# EAGLE design PaxInstrument-T400D (EAGLE 6.5.0)
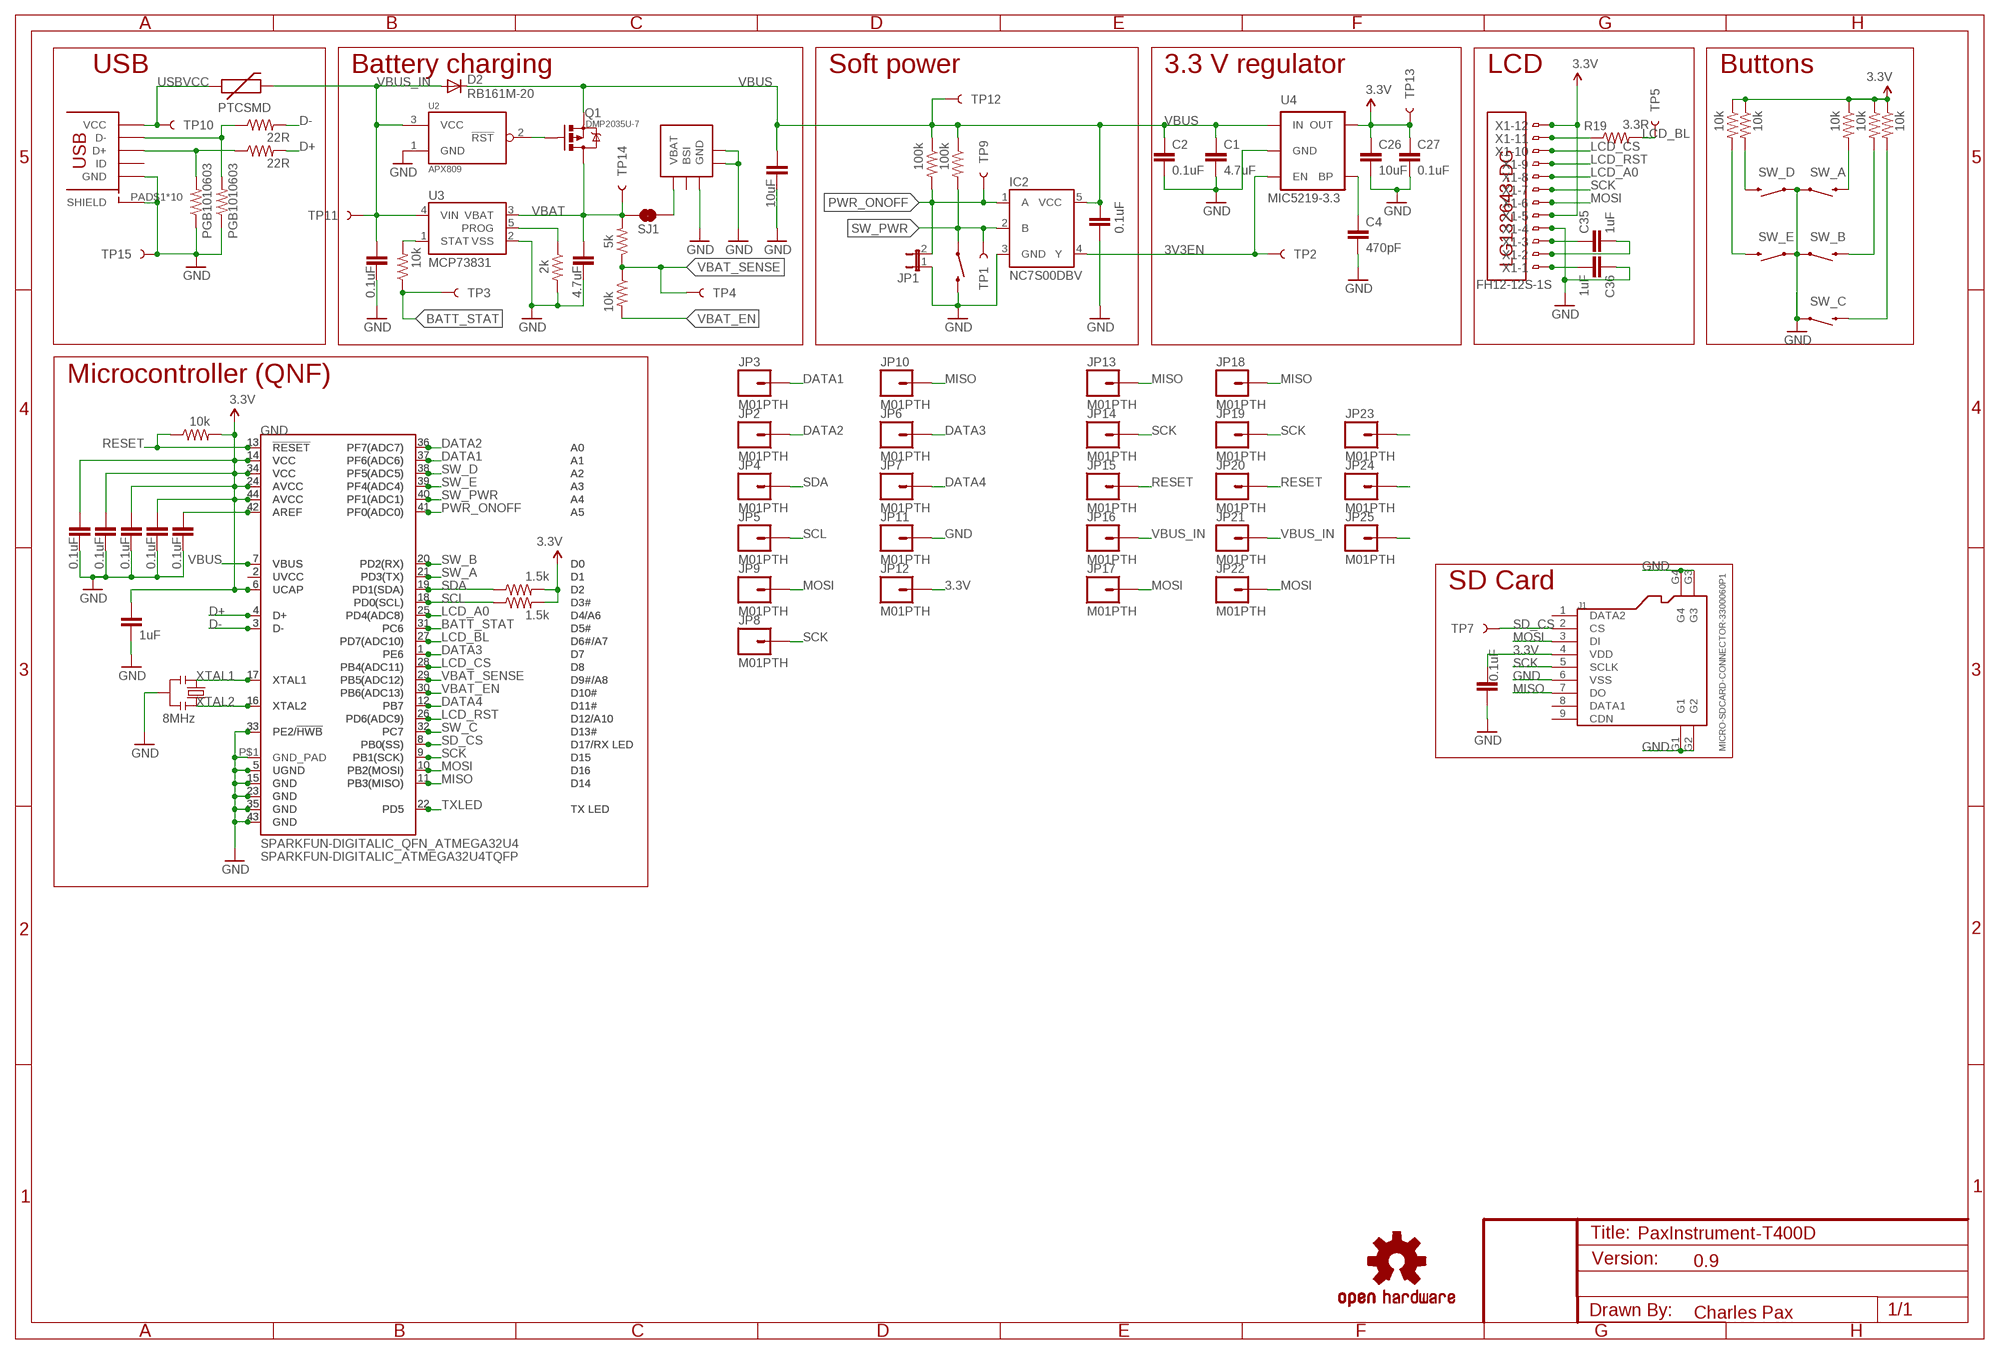
[diagram p0: schematic, sheet 1]

## Parts
C1  4.7uF  SPARKFUN-CAPACITORS_CAP0603-CAP  [SPARKFUN-CAPACITORS_0603-CAP]
C2  0.1uF  SPARKFUN-CAPACITORS_CAP0603-CAP  [SPARKFUN-CAPACITORS_0603-CAP]
C3  0.1uF  SPARKFUN-CAPACITORS_CAP0603-CAP  [SPARKFUN-CAPACITORS_0603-CAP]
C4  470pF  SPARKFUN-CAPACITORS_CAP0603-CAP  [SPARKFUN-CAPACITORS_0603-CAP]
C5  0.1uF  SPARKFUN-CAPACITORS_CAP0603-CAP  [SPARKFUN-CAPACITORS_0603-CAP]
C6  0.1uF  SPARKFUN-CAPACITORS_CAP0603-CAP  [SPARKFUN-CAPACITORS_0603-CAP]
C9  4.7uF  SPARKFUN-CAPACITORS_CAP0603-CAP  [SPARKFUN-CAPACITORS_0603-CAP]
C12  10uF  SPARKFUN-CAPACITORS_CAP0603-CAP  [SPARKFUN-CAPACITORS_0603-CAP]
C19  1uF  SPARKFUN-CAPACITORS_CAP0603-CAP  [SPARKFUN-CAPACITORS_0603-CAP]
C21  0.1uF  SPARKFUN-CAPACITORS_CAP0603-CAP  [SPARKFUN-CAPACITORS_0603-CAP]
C26  10uF  SPARKFUN-CAPACITORS_CAP0603-CAP  [SPARKFUN-CAPACITORS_0603-CAP]
C27  0.1uF  SPARKFUN-CAPACITORS_CAP0603-CAP  [SPARKFUN-CAPACITORS_0603-CAP]
C28  0.1uF  SPARKFUN-CAPACITORS_CAP0603-CAP  [SPARKFUN-CAPACITORS_0603-CAP]
C32  0.1uF  SPARKFUN-CAPACITORS_CAP0603-CAP  [SPARKFUN-CAPACITORS_0603-CAP]
C33  0.1uF  SPARKFUN-CAPACITORS_CAP0603-CAP  [SPARKFUN-CAPACITORS_0603-CAP]
C34  0.1uF  SPARKFUN-CAPACITORS_CAP0603-CAP  [SPARKFUN-CAPACITORS_0603-CAP]
C35  1uF  SPARKFUN-CAPACITORS_CAP0603-CAP  [SPARKFUN-CAPACITORS_0603-CAP]
C36  1uF  SPARKFUN-CAPACITORS_CAP0603-CAP  [SPARKFUN-CAPACITORS_0603-CAP]
D2  RB161M-20  SPARKFUN-DISCRETESEMI_DIODESOD123SOD123  [SOD123]
F1  PTCSMD  [PTC-1206]
GND  SPARKFUN-DIGITALIC_QFN_ATMEGA32U4  [SPARKFUN-DIGITALIC_SPARKFUN-DIGITALIC_QFN-44]
IC2  NC7S00DBV  [CHARLESPAX_SOT23-5]
J1  MICRO-SDCARD-CONNECTOR-3300060P1  [9P-SMD-W-RING]
JP1  JUMPER-2SMD-NO  [SJ_2S-NO]
JP2  M01PTH  [1X01]
JP3  M01PTH  [1X01]
JP4  M01PTH  [1X01]
JP5  M01PTH  [1X01]
JP6  M01PTH  [1X01]
JP7  M01PTH  [1X01]
JP8  M01PTH  [1X01]
JP9  M01PTH  [1X01]
JP10  M01PTH  [1X01]
JP11  M01PTH  [1X01]
JP12  M01PTH  [1X01]
JP13  M01PTH  [1X01]
JP14  M01PTH  [1X01]
JP15  M01PTH  [1X01]
JP16  M01PTH  [1X01]
JP17  M01PTH  [1X01]
JP18  M01PTH  [1X01]
JP19  M01PTH  [1X01]
JP20  M01PTH  [1X01]
JP21  M01PTH  [1X01]
JP22  M01PTH  [1X01]
JP23  M01PTH  [1X01]
JP24  M01PTH  [1X01]
JP25  M01PTH  [1X01]
LOGO1  OSHW-LOGOS  [OSHW-LOGO-S]
Q1  DMP2035U-7  MOSFET-PCHANNELSMT  [SOT23]
R3  2k  SPARKFUN-RESISTORS_RESISTOR0603-RES  [SPARKFUN-RESISTORS_0603-RES]
R4  10k  SPARKFUN-RESISTORS_RESISTOR0603-RES  [SPARKFUN-RESISTORS_0603-RES]
R6  100k  SPARKFUN-RESISTORS_RESISTOR0603-RES  [SPARKFUN-RESISTORS_0603-RES]
R7  100k  SPARKFUN-RESISTORS_RESISTOR0603-RES  [SPARKFUN-RESISTORS_0603-RES]
R8  10k  SPARKFUN-RESISTORS_RESISTOR0603-RES  [SPARKFUN-RESISTORS_0603-RES]
R9  22R  SPARKFUN-RESISTORS_RESISTOR0603-RES  [SPARKFUN-RESISTORS_0603-RES]
R10  22R  SPARKFUN-RESISTORS_RESISTOR0603-RES  [SPARKFUN-RESISTORS_0603-RES]
R11  10k  SPARKFUN-RESISTORS_RESISTOR0603-RES  [SPARKFUN-RESISTORS_0603-RES]
R12  10k  SPARKFUN-RESISTORS_RESISTOR0603-RES  [SPARKFUN-RESISTORS_0603-RES]
R13  1.5k  SPARKFUN-RESISTORS_RESISTOR0603-RES  [SPARKFUN-RESISTORS_0603-RES]
R14  1.5k  SPARKFUN-RESISTORS_RESISTOR0603-RES  [SPARKFUN-RESISTORS_0603-RES]
R15  10k  SPARKFUN-RESISTORS_RESISTOR0603-RES  [SPARKFUN-RESISTORS_0603-RES]
R16  10k  SPARKFUN-RESISTORS_RESISTOR0603-RES  [SPARKFUN-RESISTORS_0603-RES]
R17  10k  SPARKFUN-RESISTORS_RESISTOR0603-RES  [SPARKFUN-RESISTORS_0603-RES]
R19  3.3R  SPARKFUN-RESISTORS_RESISTOR0603-RES  [SPARKFUN-RESISTORS_0603-RES]
R20  5k  SPARKFUN-RESISTORS_RESISTOR0603-RES  [SPARKFUN-RESISTORS_0603-RES]
R24  10k  SPARKFUN-RESISTORS_RESISTOR0603-RES  [SPARKFUN-RESISTORS_0603-RES]
S1  SWITCH-MOMENTARY-2SMD  [TACTILE_SWITCH_SMD]
S2  SWITCH-MOMENTARY-2SMD  [TACTILE_SWITCH_SMD]
S3  SWITCH-MOMENTARY-2SMD  [TACTILE_SWITCH_SMD]
S4  SWITCH-MOMENTARY-2SMD  [TACTILE_SWITCH_SMD]
S5  SWITCH-MOMENTARY-2SMD  [TACTILE_SWITCH_SMD]
S6  SWITCH-MOMENTARY-2SMD  [TACTILE_SWITCH_SMD]
SJ1  JUMPER-PAD-2-NC_BY_TRACE  [PAD-JUMPER-2-NC_BY_TRACE_YES_SILK]
TP1  SW_PWR  TEST-POINTTP_15TH_THRU  [TP_15TH]
TP2  3V3_EN  TEST-POINTTP_15TH_THRU  [TP_15TH]
TP3  BATT_STAT  TEST-POINTTP_15TH_THRU  [TP_15TH]
TP4  VBAT_SENSE  TEST-POINTTP_15TH_THRU  [TP_15TH]
TP5  LCD_BL  TEST-POINTTP_15TH_THRU  [TP_15TH]
TP7  SD_CS  TEST-POINTTP_15TH_THRU  [TP_15TH]
TP9  PWR_ON/OFF  TEST-POINTTP_15TH_THRU  [TP_15TH]
TP10  TEST-POINTTP_15TH_THRU  [TP_15TH]
TP11  VBUS_IN  TEST-POINTTP_15TH_THRU  [TP_15TH]
TP12  VBUS  TEST-POINTTP_15TH_THRU  [TP_15TH]
TP13  3.3V  TEST-POINTTP_15TH_THRU  [TP_15TH]
TP14  VBAT  TEST-POINTTP_15TH_THRU  [TP_15TH]
TP15  GND  TEST-POINTTP_15TH_THRU  [TP_15TH]
U2  APX809  [SOT23]
U3  MCP73831  [SOT23-5]
U4  MIC5219-3.3V  V_REG_LDOSMD  [SOT23-5]
U$1  USB_MICROSMT+THRUHULE  [USB_MICRO_THRUHOLE]
U$2  BL-5C-CONNECTOR  [BL-5C-CONNECTOR]
U$3  SPARKFUN-DIGITALIC_ATMEGA32U4TQFP  [SPARKFUN-DIGITALIC_SPARKFUN-DIGITALIC_TQFP44]
U$5  LG132643-DG  [LG132643-DG]
X1  FH12-12S-1S  [FH12-12S-1SH]
X2  FH12-12S-0.5SH  [FH12-12S-0.5SH]
Y1  RESONATORSMD  [RESONATOR-SMD]
Z1  PGB1010603  SPARKFUN-RESISTORS_RESISTOR0603-RES  [SPARKFUN-RESISTORS_0603-RES]
Z2  PGB1010603  SPARKFUN-RESISTORS_RESISTOR0603-RES  [SPARKFUN-RESISTORS_0603-RES]

## Nets
3.3V: C5.1 C19.1 C21.2 C26.1 C27.1 C32.1 C33.1 C34.1 GND.6(UCAP) GND.14(VCC) GND.24(AVCC) GND.34(VCC) GND.44(AVCC) J1.4(VDD) JP12.1 R4.2 R8.1 R11.1 R12.1 R13.2 R14.2 R15.1 R16.1 TP13.P$1 U4.5(OUT) U$3.6(UCAP) U$3.14(VCC) U$3.24(AVCC) U$3.34(VCC) U$3.44(AVCC) X1.5 X1.12 X2.5 X2.12
3V3EN: IC2.4(Y) TP2.P$1 U4.3(EN)
BATT_STAT: GND.31(PC6) R17.1 TP3.P$1 U$3.31(PC6)
D+: GND.4(D+) R9.2 U$3.4(D+)
D-: GND.3(D-) R10.2 U$3.3(D-)
DATA1: GND.37(PF6(ADC6)) JP3.1 U$3.37(PF6(ADC6))
DATA2: GND.36(PF7(ADC7)) JP2.1 U$3.36(PF7(ADC7))
DATA3: GND.1(PE6) JP6.1 U$3.1(PE6)
DATA4: GND.12(PB7) JP7.1 U$3.12(PB7)
GND: C1.2 C2.2 C3.2 C4.2 C5.2 C6.2 C9.2 C12.2 C19.2 C21.1 C26.2 C27.2 C28.2 C32.2 C33.2 C34.2 C36.1 GND.5(UGND) GND.15(GND) GND.23(GND) GND.33(PE2/!HWB) GND.35(GND) GND.43(GND) GND.P$1(GND_PAD) IC2.3(GND) J1.6(VSS) J1.G1 J1.G2 J1.G3 J1.G4 JP1.1 JP11.1 R3.2 S1.1 S2.1 S3.1 S4.1 S5.1 S6.3 TP15.P$1 U2.1(GND) U3.2(VSS) U4.2(GND) U$1.PAD$1(SHIELD) U$1.PAD$2(SHIELD) U$1.PAD$3(SHIELD) U$1.PAD$4(SHIELD) U$1.PAD$5(SHIELD) U$1.PAD$6(SHIELD) U$1.PAD$7(SHIELD) U$1.PAD$8(SHIELD) U$1.PAD$9(SHIELD) U$1.PAD$10(SHIELD) U$1.PIN$5(GND) U$2.P$3(GND) U$2.P$4 U$2.P$5 U$3.5(UGND) U$3.15(GND) U$3.23(GND) U$3.33(PE2/!HWB) U$3.35(GND) U$3.43(GND) X1.4 X2.4 Y1.2 Z1.1 Z2.1
LCD_A0: GND.25(PD4(ADC8)) U$3.25(PD4(ADC8)) X1.8 X2.8
LCD_BL: GND.27(PD7(ADC10)) R19.2 TP5.P$1 U$3.27(PD7(ADC10))
LCD_CS: GND.28(PB4(ADC11)) U$3.28(PB4(ADC11)) X1.10 X2.10
LCD_RST: GND.26(PD6(ADC9)) U$3.26(PD6(ADC9)) X1.9 X2.9
MISO: GND.11(PB3(MISO)) J1.7(DO) JP10.1 JP13.1 JP18.1 U$3.11(PB3(MISO))
MOSI: GND.10(PB2(MOSI)) J1.3(DI) JP9.1 JP17.1 JP22.1 U$3.10(PB2(MOSI)) X1.6 X2.6
MOSI2: JP25.1
N$1: C4.1 U4.4(BP)
N$2: R17.2 U3.1(STAT)
N$4: R19.1 X1.11 X2.11
N$7: R3.1 U3.5(PROG)
N$10: SJ1.2 U$2.P$1(VBAT)
N$12: Q1.1(G) U2.2(!RST)
N$15: C3.1 GND.42(AREF) U$3.42(AREF)
N$17: GND.2(UVCC) U$3.2(UVCC)
N$31: R10.1 U$1.PIN$2(D-) Z2.2
N$33: R9.1 U$1.PIN$3(D+) Z1.2
N$37: C35.1 X1.3 X2.3
N$38: C35.2 X1.2 X2.2
N$39: C36.2 X1.1 X2.1
PWR_ONOFF: GND.41(PF0(ADC0)) IC2.1(A) JP1.2 R7.2 TP9.P$1 U$3.41(PF0(ADC0))
RESET: GND.13(!RESET) JP15.1 JP20.1 R4.1 U$3.13(!RESET)
RESET1: JP23.1
SCK: GND.9(PB1(SCK)) J1.5(SCLK) JP8.1 JP14.1 JP19.1 U$3.9(PB1(SCK)) X1.7 X2.7
SCL: GND.18(PD0(SCL)) JP5.1 R14.1 U$3.18(PD0(SCL))
SD_CS: GND.8(PB0(SS)) J1.2(CS) TP7.P$1 U$3.8(PB0(SS))
SDA: GND.19(PD1(SDA)) JP4.1 R13.1 U$3.19(PD1(SDA))
SW_A: GND.21(PD3(TX)) R8.2 S3.3 U$3.21(PD3(TX))
SW_B: GND.20(PD2(RX)) R11.2 S2.3 U$3.20(PD2(RX))
SW_C: GND.32(PC7) R12.2 S1.3 U$3.32(PC7)
SW_D: GND.38(PF5(ADC5)) R15.2 S4.3 U$3.38(PF5(ADC5))
SW_E: GND.39(PF4(ADC4)) R16.2 S5.3 U$3.39(PF4(ADC4))
SW_PWR: GND.40(PF1(ADC1)) IC2.2(B) R6.2 S6.1 TP1.P$1 U$3.40(PF1(ADC1))
TXLED: GND.22(PD5) U$3.22(PD5)
USBVCC [power]: F1.1 TP10.P$1 U$1.PIN$1(VCC)
VBAT: C9.1 Q1.3(D) R20.2 SJ1.1 TP14.P$1 U3.3(VBAT)
VBAT_EN: GND.30(PB6(ADC13)) R24.2 U$3.30(PB6(ADC13))
VBAT_SENSE: GND.29(PB5(ADC12)) R20.1 R24.1 TP4.P$1 U$3.29(PB5(ADC12))
VBUS [power]: C1.1 C2.1 C12.1 C28.1 D2.C GND.7(VBUS) IC2.5(VCC) Q1.2(S) R6.1 R7.1 TP12.P$1 U4.1(IN) U$3.7(VBUS)
VBUS_IN [power]: C6.1 D2.A F1.2 JP16.1 JP21.1 TP11.P$1 U2.3(VCC) U3.4(VIN)
VBUS_IN1 [power]: JP24.1
XTAL1: GND.17(XTAL1) U$3.17(XTAL1) Y1.1
XTAL2: GND.16(XTAL2) U$3.16(XTAL2) Y1.3
Unconnected: J1.1(DATA2) J1.8(DATA1) J1.9(CDN) U$1.PIN$4(ID) U$2.P$2(BSI)

## Notes on the sheet
- USB | Battery charging | Soft power | 3.3 V regulator | LCD | Buttons
- MIC5219-3.3
- Microcontroller (QNF)
- SD Card
- 8MHz
- 0.9
- Charles Pax

## Library data of the parts
C1 C9 = PaxInstrument-T400:SPARKFUN-CAPACITORS_CAP: Capacitor Standard 0603 ceramic capacitor, and 0.1" leaded capacitor.; MPN: GRM188R60J475KE19D; OC_DIGIKEY: 490-3297-2-ND
C2 C3 C5 C6 C21 C27 C28 C32-C34 = PaxInstrument-T400:SPARKFUN-CAPACITORS_CAP: Capacitor Standard 0603 ceramic capacitor, and 0.1" leaded capacitor.; MPN: CL10B104KO8NNNC; OC_DIGIKEY: 1276-1005-2-ND
C4 = PaxInstrument-T400:SPARKFUN-CAPACITORS_CAP: Capacitor Standard 0603 ceramic capacitor, and 0.1" leaded capacitor.; MPN: C1608X5R1A474K080AA; OC_DIGIKEY: 445-1320-2-ND
C12 C26 = PaxInstrument-T400:SPARKFUN-CAPACITORS_CAP: Capacitor Standard 0603 ceramic capacitor, and 0.1" leaded capacitor.; MPN: JMK107ABJ106MAHT; OC_DIGIKEY: 587-3383-2-ND
C19 C35 C36 = PaxInstrument-T400:SPARKFUN-CAPACITORS_CAP: Capacitor Standard 0603 ceramic capacitor, and 0.1" leaded capacitor.; MPN: LMK107B7105KA-T; OC_DIGIKEY: 587-1242-2-ND
D2 = PaxInstrument-T400:SPARKFUN-DISCRETESEMI_DIODE: Diode These are standard reverse protection diodes and small signal diodes. SMA package can handle up to about 1A. SOD-323 can handle about 200mA. What the SOD-323 package when ordering, there are some mfgs out there that are 5-pin packages.; MPN: B340A-13-F; OC_DIGIKEY: B340A-FDICT-ND
F1 = SparkFun:PTC: Resettable Fuse PTC Resettable Fuse. Spark Fun Electronics SKU : COM-08357; MPN: MF-NSMF050-2; OC_DIGIKEY: MF-NSMF050-2TR-ND
GND = PaxInstrument-T400:SPARKFUN-DIGITALIC_QFN_ATMEGA32U4
IC2 = PaxInstrument-T400:NC7S00
J1 = SeeesStudio-OPL:MICRO-SDCARD-CONNECTOR: Micro SD Card
JP1 = SparkFun-Passives:JUMPER-2: Jumper Basic 0.1" spaced jumper. Use with breakaway headers.
JP2-JP25 = SparkFun-Connectors:M01: Header 1 Standard 1-pin 0.1" header. Use with straight break away headers (SKU : PRT-00116), right angle break away headers (PRT-00553), swiss pins (PRT-00743), machine pins (PRT-00117), and female headers (PRT-00115).
LOGO1 = SparkFun-Aesthetics:OSHW-LOGO: Open Source Hardware Logo This logo indicates the piece of hardware it is found on incorporates a OSHW license and/or adheres to the definition of open source hardware found here: http://freedomdefined.org/OSHW; MPN: N/A; OC_DIGIKEY: N/A
Q1 = PaxInstrument-T400:MOSFET-PCHANNEL: Generic PMOSFET
R3 = PaxInstrument-T400:SPARKFUN-RESISTORS_RESISTOR: Resistor Basic schematic elements and footprints for 0603, 1206, and PTH resistors.; MPN: ESR03EZPJ202; OC_DIGIKEY: RHM2.0KDTR-ND
R4 R6-R8 R11 R12 R15-R17 R20 R24 = PaxInstrument-T400:SPARKFUN-RESISTORS_RESISTOR: Resistor Basic schematic elements and footprints for 0603, 1206, and PTH resistors.; MPN: RC1608J103CS; OC_DIGIKEY: 1276-5086-2-ND
R9 R10 = PaxInstrument-T400:SPARKFUN-RESISTORS_RESISTOR: Resistor Basic schematic elements and footprints for 0603, 1206, and PTH resistors.; MPN: RC0603JR-0722RL; OC_DIGIKEY: 311-22GRTR-ND
R13 R14 = PaxInstrument-T400:SPARKFUN-RESISTORS_RESISTOR: Resistor Basic schematic elements and footprints for 0603, 1206, and PTH resistors.; MPN: RC0603JR-071K5L; OC_DIGIKEY: 311-1.5KGRTR-ND
R19 = PaxInstrument-T400:SPARKFUN-RESISTORS_RESISTOR: Resistor Basic schematic elements and footprints for 0603, 1206, and PTH resistors.
S1-S6 = SparkFun-Electromechanical:SWITCH-MOMENTARY-2: Various NO switches- pushbuttons, reed, etc
SJ1 = SparkFun-Passives:JUMPER-PAD-2-NC_BY_TRACE
TP1-TP5 TP7 TP9-TP14 = PaxInstrument-T400:TEST-POINT: Bare copper test points for troubleshooting or ICT; MPN: N/A; OC_DIGIKEY: N/A
TP15 = PaxInstrument-T400:TEST-POINT: Bare copper test points for troubleshooting or ICT
U2 = PaxInstrument-T400:APX809
U3 = SparkFun-PowerIC:MCP73831: Miniature single cell, fully integrated Li-Ion, Li-polymer charge management controller http://ww1.microchip.com/downloads/en/DeviceDoc/21984a.pdf IC-09995; MPN: MCP73831T-2DCI/OT; OC_DIGIKEY: MCP73831T-2DCI/OTTR-ND; PROD_ID: IC-09995
U4 = SparkFun:V_REG_LDO: Voltage Regulator LDO Standard 150mA LDO voltage regulator in SOT-23 layout. Micrel part MIC5205. BP (by-pass) pin is used to lower output noise with 470pF cap.; MPN: MIC5219-3.3YM5 TR; OC_DIGIKEY: 576-1281-2-ND
U$1 = blinkinlabs:USB_MICRO; MPN: 10118194-0001LF; OC_DIGIKEY: 609-4618-2-ND
U$2 = charlespax:BL-5C-CONNECTOR
U$3 = PaxInstrument-T400:SPARKFUN-DIGITALIC_ATMEGA32U4: Atmel 44-pin 8-bit Microcontroller with 32KBytes of ISP Flash and USB Controller ----- Please use the QFN-44-NOPAD_1:1 package for the footprint of all boards using a 32U4. Route traces directly away from the pads as much as possible.
U$5 = charlespax:LG132643-DG; MPN: LG132643-DW
X1 = PaxInstrument-T400:FH12-12S-1S
X2 = con-hirose:FH12-12S-0.5S: 0.5mm Pitch Connectors For FPC/FFC Source: Data sheet <http://www.hirose.co.jp/cataloge_hp/e58605370.pdf>; MPN: FH12-12S-0.5SH(55); OC_FARNELL: 1324542; OC_NEWARK: 34M6155
Y1 = SparkFun:RESONATOR: Resonator Small SMD resonator. This is the itty bitty 10/20MHz resonators with built in caps. CSTCE10M0G55 and CSTCE20M0V53. Footprint has been reviewed closely but hasn't been tested yet.; MPN: CSTCE8M00G52-R0; OC_DIGIKEY: 490-5994-2-ND
Z1 Z2 = PaxInstrument-T400:SPARKFUN-RESISTORS_RESISTOR: Resistor Basic schematic elements and footprints for 0603, 1206, and PTH resistors.; MPN: PGB1010603NRHF; OC_DIGIKEY: F4239CT-ND

## Net classes
0 default: width 0.203 mm, drill 0.33 mm
1 power: width 0.305 mm

## Board
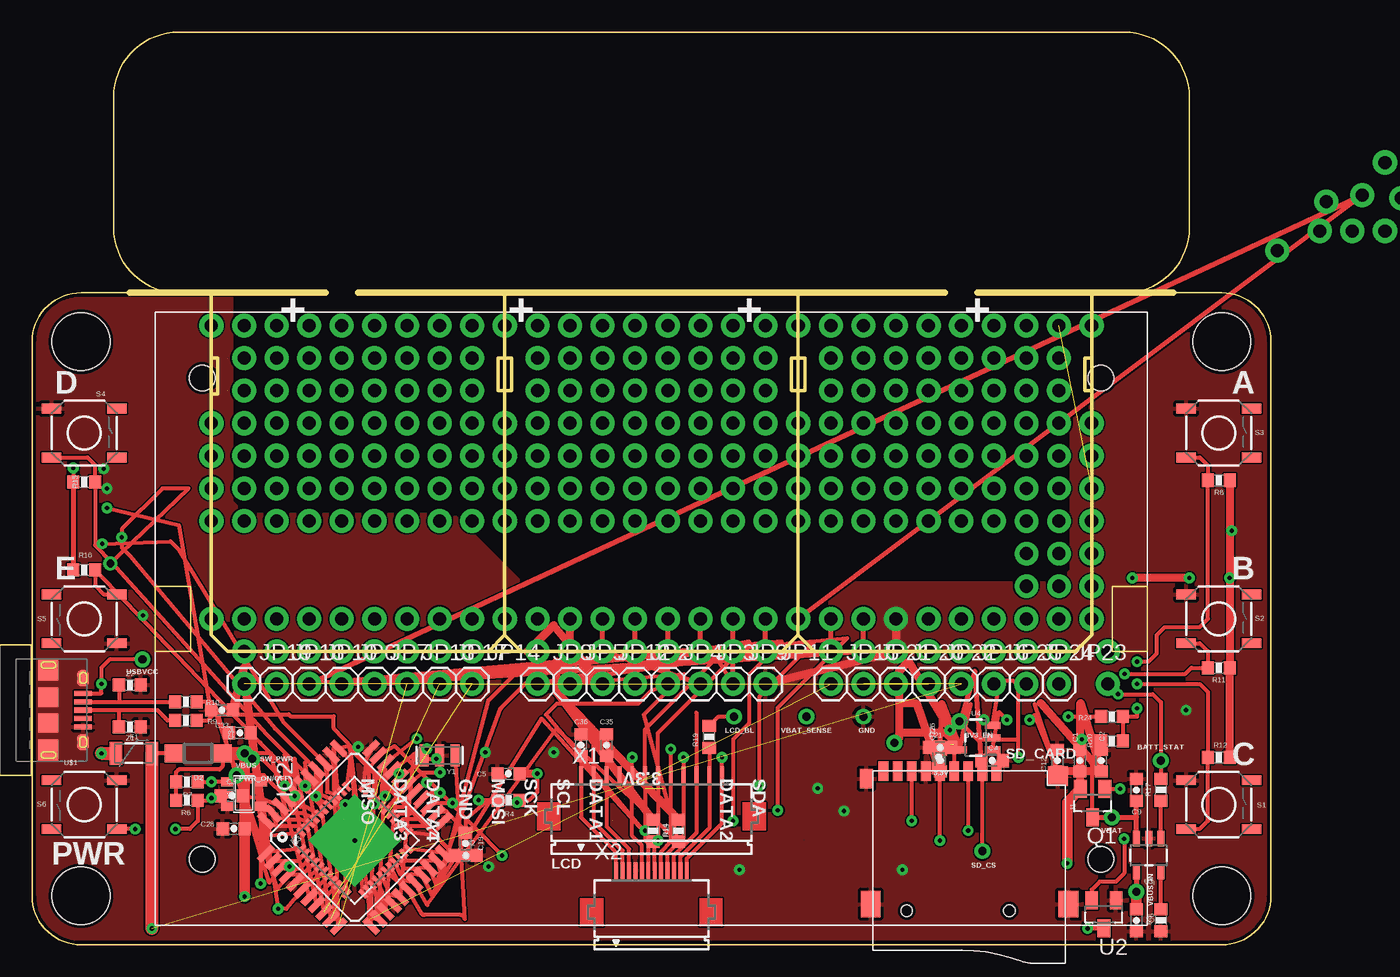
[diagram p1: board, top side]
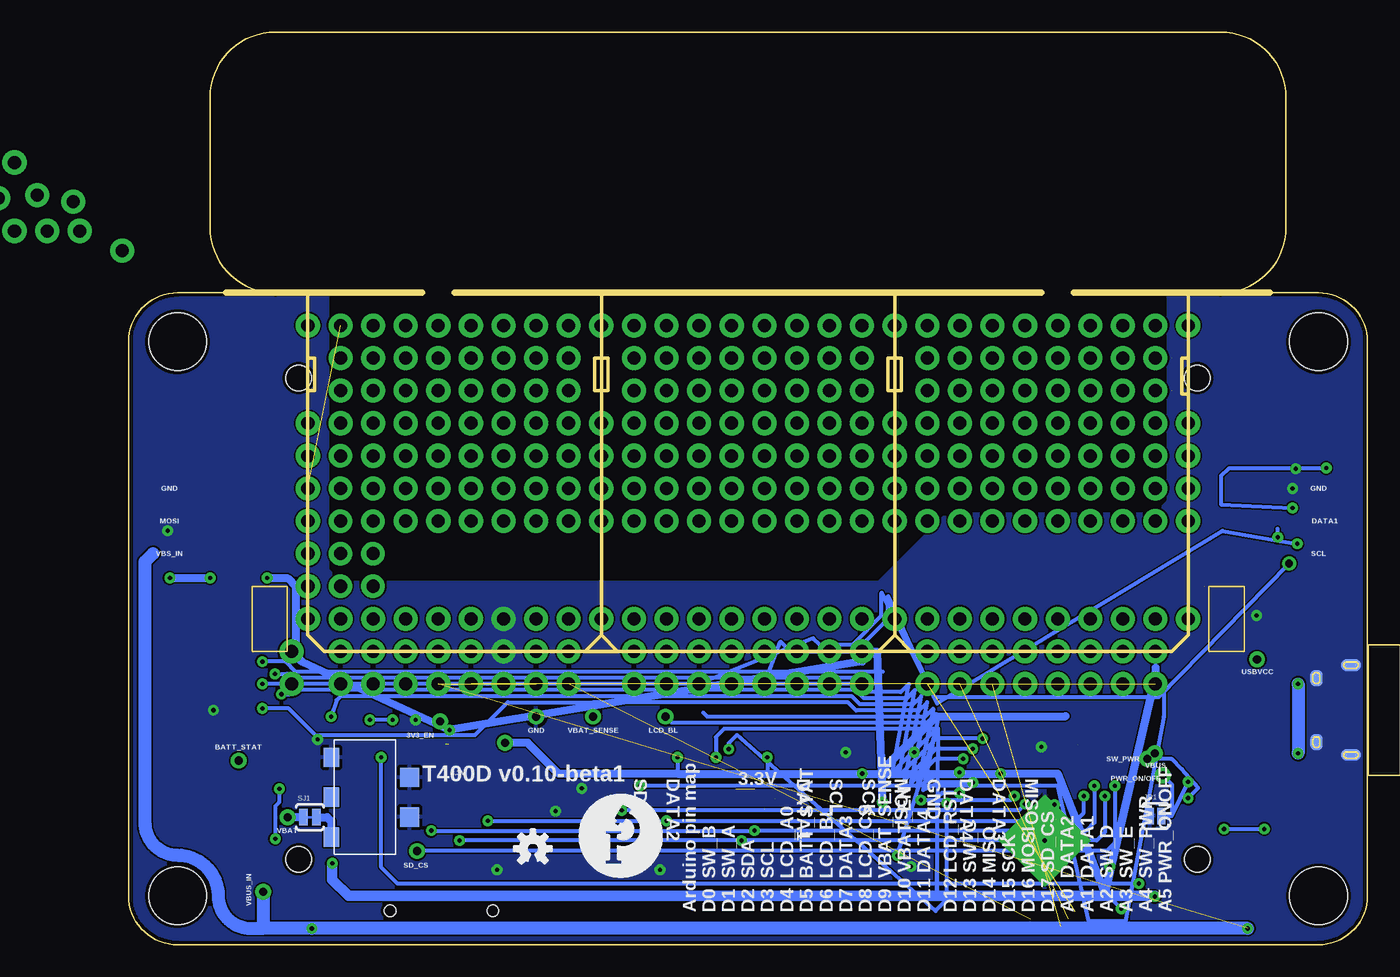
[diagram p2: board, bottom side, seen from below]

Size 96.52 x 71.12 mm. Coordinates in mm from the lower left corner, seen from the top.
Outline: 11.43,50.8 arc-90 6.35,55.88 6.35,66.04 arc-90 11.43,71.12 85.09,71.12 arc-90 90.17,66.04 90.17,55.88 arc-90 85.09,50.8
Outline: 79.76,50.8 92.71,50.8 arc-90 96.52,46.99 96.52,3.81 arc-90 92.71,0 3.81,0 arc-90 0,3.81 0,46.99 arc-90 3.81,50.8 16.51,50.8
Copper layers (1*16): Top 0.035mm / dielectric 1.5mm / Bottom 0.035mm
Design rules "PaxInstrument-T400 *": minimum track width 6mil, minimum drill 13mil, track to track 5mil, track to pad 5mil, pad to pad 5mil, via to via 5mil, smd to smd 5mil, copper to edge 10mil, drill to drill 8mil, minimum pad ring 12mil, minimum via ring 10mil, stop-mask expansion 4mil, vias tented up to drill 25mil, thermal gap 10mil
Holes 4.5 mm at 92.71,3.81 92.71,46.99 3.81,46.99 3.81,3.81
tKeepout: area 0.3,0.3 to 7.3,7.3; area 0.3,43.5 to 7.3,50.5; area 89.2,43.5 to 96.2,50.5; area 89.2,0.3 to 96.2,7.3
Milling: 44 lines

### Footprints (pad centres in the part's own frame; a part is rotated, then mirrored left to right if it is on the bottom)
SPARKFUN-CAPACITORS_0603-CAP = smd 0.94 x 1.016: 1 -0.85,0; 2 0.85,0
SOD123 = smd 1.4 x 1.4: A 1.9,0; C -1.9,0
PTC-1206 = smd 1 x 1.8: 1 -1.4,0; 2 1.4,0
SPARKFUN-DIGITALIC_SPARKFUN-DIGITALIC_QFN-44 = smd 0.8 x 0.3: 1 -3.4,2.5; 2 -3.4,2; 3 -3.4,1.5; 4 -3.4,1; 5 -3.4,0.5; 6 -3.4,0; 7 -3.4,-0.5; 8 -3.4,-1; 9 -3.4,-1.5; 10 -3.4,-2; 11 -3.4,-2.5; 23 3.4,-2.5; 24 3.4,-2; 25 3.4,-1.5; 26 3.4,-1; 27 3.4,-0.5; 28 3.4,0; 29 3.4,0.5; 30 3.4,1; 31 3.4,1.5; 32 3.4,2; 33 3.4,2.5 | smd 0.3 x 0.8: 12 -2.5,-3.4; 13 -2,-3.4; 14 -1.5,-3.4; 15 -1,-3.4; 16 -0.5,-3.4; 17 0,-3.4; 18 0.5,-3.4; 19 1,-3.4; 20 1.5,-3.4; 21 2,-3.4; 22 2.5,-3.4; 34 2.5,3.4; 35 2,3.4; 36 1.5,3.4; 37 1,3.4; 38 0.5,3.4; 39 0,3.4; 40 -0.5,3.4; 41 -1,3.4; 42 -1.5,3.4; 43 -2,3.4; 44 -2.5,3.4 | drill 0.33 pad 5.08 square: P$1 0,0
CHARLESPAX_SOT23-5 = smd 0.69 x 0.99: 1 -0.95,-1.29; 2 0,-1.29; 3 0.95,-1.29; 4 0.95,1.3; 5 -0.95,1.3
9P-SMD-W-RING = smd 1.524 x 0.762: 1 -7.493,2.114; 2 -7.493,1.014; 3 -7.493,-0.086; 4 -7.493,-1.186; 5 -7.493,-2.286; 6 -7.493,-3.386; 7 -7.493,-4.486; 8 -7.493,-5.586; 9 -7.493,-6.686 | smd 1.524 x 1.016: G1 -6.893,-8.032 | smd 2.032 x 1.524: G2 2.88,-7.686; G3 2.88,7.714 | smd 1.524 x 1.524: G4 -7.101,6.895 | hole 0.889: 3.407,-4.886; 3.407,3.114
SJ_2S-NO = smd 0.635 x 1.27: 1 -0.45,0; 2 0.45,0
1X01 = drill 1.016 pad 1.88: 1 0,0
SOT23 = smd 1 x 1.4: 1 -0.95,-1.1; 2 0.95,-1.1; 3 0,1.1
SPARKFUN-RESISTORS_0603-RES = smd 0.94 x 1.016: 1 -0.85,0; 2 0.85,0
TACTILE_SWITCH_SMD = smd 1.524 x 0.762: 1 -2.54,1.905; 2 2.54,1.905; 3 -2.54,-1.905; 4 2.54,-1.905
PAD-JUMPER-2-NC_BY_TRACE_YES_SILK = smd 0.635 x 1.27: 1 -0.508,0; 2 0.508,0
TP_15TH = drill 0.63 pad 1.168: P$1 0,0
SOT23-5 = smd 0.55 x 1.2: 1 -0.95,-1.3; 2 0,-1.3; 3 0.95,-1.3; 4 0.95,1.3; 5 -0.95,1.3
USB_MICRO_THRUHOLE = smd 1.645 x 1.55: PAD$1 -3.123,0; PAD$4 3.123,0 | smd 1.5 x 1.55: PAD$2 -1,0; PAD$3 1,0 | smd 1.25 x 0.95: PAD$5 -2.5,2.7; PAD$6 2.5,2.7 | smd 0.9 x 1.55 bottom: PAD$7 -3.5,0; PAD$8 3.5,0 | smd 1.25 x 0.95 bottom: PAD$9 -2.5,2.7; PAD$10 2.5,2.7 | smd 0.4 x 1.35: PIN$1 -1.3,2.7; PIN$2 -0.65,2.7; PIN$3 0,2.7; PIN$4 0.65,2.7; PIN$5 1.3,2.7
BL-5C-CONNECTOR = smd 1.5 x 1.2: P$1 3.1,-0.2; P$2 0,-0.2; P$3 -3.1,-0.2 | smd 1.5 x 1.5: P$4 1.55,5.9; P$5 -1.55,5.9
SPARKFUN-DIGITALIC_SPARKFUN-DIGITALIC_TQFP44 = smd 1.5 x 0.5: 1 -5.8,4; 2 -5.8,3.2; 3 -5.8,2.4; 4 -5.8,1.6; 5 -5.8,0.8; 6 -5.8,0; 7 -5.8,-0.8; 8 -5.8,-1.6; 9 -5.8,-2.4; 10 -5.8,-3.2; 11 -5.8,-4; 23 5.8,-4; 24 5.8,-3.2; 25 5.8,-2.4; 26 5.8,-1.6; 27 5.8,-0.8; 28 5.8,0; 29 5.8,0.8; 30 5.8,1.6; 31 5.8,2.4; 32 5.8,3.2; 33 5.8,4 | smd 0.5 x 1.5: 12 -4,-5.8; 13 -3.2,-5.8; 14 -2.4,-5.8; 15 -1.6,-5.8; 16 -0.8,-5.8; 17 0,-5.8; 18 0.8,-5.8; 19 1.6,-5.8; 20 2.4,-5.8; 21 3.2,-5.8; 22 4,-5.8; 34 4,5.8; 35 3.2,5.8; 36 2.4,5.8; 37 1.6,5.8; 38 0.8,5.8; 39 0,5.8; 40 -0.8,5.8; 41 -1.6,5.8; 42 -2.4,5.8; 43 -3.2,5.8; 44 -4,5.8
LG132643-DG = hole 2: -35,-18.75; 35,-18.75; 35,18.75; -35,18.75
FH12-12S-1SH = smd 0.3 x 1.3: 1 -5.5,3.25; 2 -4.5,3.25; 3 -3.5,3.25; 4 -2.5,3.25; 5 -1.5,3.25; 6 -0.5,3.25; 7 0.5,3.25; 8 1.5,3.25; 9 2.5,3.25; 10 3.5,3.25; 11 4.5,3.25; 12 5.5,3.25
FH12-12S-0.5SH = smd 0.3 x 1.3: 1 -2.75,3.25; 2 -2.25,3.25; 3 -1.75,3.25; 4 -1.25,3.25; 5 -0.75,3.25; 6 -0.25,3.25; 7 0.25,3.25; 8 0.75,3.25; 9 1.25,3.25; 10 1.75,3.25; 11 2.25,3.25; 12 2.75,3.25
RESONATOR-SMD = smd 0.7 x 1.7: 1 -1.2,0; 2 0,0; 3 1.2,0

### Placement (x,y rotation side)
C1  81.63,14.35 90 top
C2  83.3,14.35 90 top
C3  15.56,11.62 180 top
C4  74.8,14.35 0 top
C5  37.12,13.34 180 top
C6  86.04,1.91 270 top
C9  86.04,12.06 90 top
C12  79.88,14.35 90 top
C19  33.78,7.87 270 top
C21  70.74,15.37 0 top
C26  70.63,14.61 90 top
C27  70.75,14.35 90 top
C28  15.72,9.05 180 top
C32  33.78,6.95 0 top
C33  14.8,18.29 180 top
C34  16.19,16.51 180 top
C35  44.76,15.56 90 top
C36  42.76,15.56 270 top
D2  12.94,14.92 180 top
F1  7.94,14.92 0 top
GND  25.15,8.13 45 top
IC2  16.51,11.75 270 top
J1  73.03,6.05 270 top
JP1  16.51,10.03 0 bottom
JP2  46.99,20.32 0 top
JP3  52.07,20.32 0 top
JP4  49.53,20.32 0 top
JP5  41.91,20.32 0 top
JP6  24.13,20.32 0 top
JP7  26.67,20.32 0 top
JP8  39.37,20.32 0 top
JP9  54.61,20.32 0 top
JP10  21.59,20.32 0 top
JP11  57.15,20.32 0 top
JP12  44.45,20.32 0 top
JP13  29.21,20.32 0 top
JP14  34.29,20.32 0 top
JP15  62.23,20.32 0 top
JP16  72.39,20.32 0 top
JP17  31.75,20.32 0 top
JP18  19.05,20.32 0 top
JP19  16.51,20.32 0 top
JP20  67.31,20.32 0 top
JP21  64.77,20.32 0 top
JP22  69.85,20.32 0 top
JP23  80.01,20.32 0 top
JP24  77.47,20.32 0 top
JP25  74.93,20.32 0 top
LOGO1  65.02,7.49 0 bottom
Q1  82.63,11.04 180 top
R3  87.95,1.91 270 top
R4  37.12,11.27 0 top
R6  12.06,11.27 0 top
R7  12.06,12.7 0 top
R8  92.46,36.2 180 top
R9  11.99,17.48 0 top
R10  11.99,18.94 0 top
R11  92.46,21.59 180 top
R12  92.46,14.61 180 top
R13  48.39,8.89 90 top
R14  50.36,8.89 90 top
R15  4.06,36.07 0 top
R16  4.06,29.21 0 top
R17  87.94,12.06 270 top
R19  52.76,16.19 90 top
R20  84.14,15.88 180 top
R24  84.14,17.78 180 top
S1  92.46,10.92 0 top
S2  92.46,25.4 0 top
S3  92.46,39.88 0 top
S4  4.06,39.88 0 top
S5  4.06,25.4 180 top
S6  4.06,10.92 180 top
SJ1  82.39,9.95 0 bottom
TP1  17.14,14.48 0 top
TP2  72.26,17.4 180 top
TP3  87.94,14.35 270 top
TP4  60.33,17.78 90 top
TP5  54.67,17.78 0 top
TP7  74.04,7.3 0 top
TP9  15.93,13.21 0 bottom
TP10  8.6,22.23 0 top
TP11  86.04,4.13 0 top
TP12  16.57,14.92 0 bottom
TP13  67.2,15.75 0 bottom
TP14  84.14,9.95 90 top
TP15  64.77,17.78 0 top
U2  83.5,2.37 180 top
U3  87,6.99 180 top
U4  73.53,16.13 90 top
U$1  1.27,18.29 270 top
U$2  80.52,11.5 270 bottom
U$3  25.15,8.38 45 top
U$5  48.26,25.4 0 bottom
U$6  [PAXINSTRUMENT_LOGO]  61.59,5.08 0 bottom
X1  48.26,10 0 top
X2  48.26,2.54 0 top
Y1  31.75,14.76 180 top
Z1  7.62,16.99 180 top
Z2  7.62,20.24 180 top

### Tracks (layer width: path | path; a pad name or v marks a point on that pad's centre or on a via)
3.3V  (via drill 0.33, 1.02 pad 1.88)  (6 unrouted)
  Top 0.305: GND.6 U$3.6 19.81,2.79 v19.18,2.79 C34.1 | GND.24 29.07,9.22 30.77,9.22 U$3.24 31.96,10.41 32.26,10.41 33.78,8.89 C19.1 33.78,9.78 35.34,11.09 v37.78,11.09 | GND.34 24.76,14.42 U$3.34 24.55,15.48 C32.1 23.5,16.86 23.5,17.81 20.16,17.81 20,17.97 13.97,17.97 11.43,32.7 v5.84,34.04 | GND.44 18.6,8.51 U$3.44 16.51,22.17 16.51,21.59 | GND.14 26.8,3.85 26.8,2.58 U$3.14 28.57,13.75 v28.57,13.34 | v3.21,37.15 R15.1 | v46.76,14.61 X1.5 46.76,8.48 47.51,7.74 X2.5 | v53.76,14.61 X1.12 53.76,9.47 51.01,6.72 X2.12 | R4.2 38.73,11.27 39.37,11.91 v39.37,13.34 | 73.11,18.73 U4.5 72.86,18.62 | 71.84,15.62 J1.4 | 71.84,15.88 71.59,15.62 C21.2
  Top 0.406: R15.1 R16.1 | 70.88,18.73 C26.1
  Top 0.61: R12.1 R11.1 v93.31,28.57 R8.1 | U4.5 70.88,18.73 | R14.2 40.89,19.65 | 40.89,19.65 R13.2 | C33.1 16.51,21.59 | v39.37,13.34 C5.1 | v90.17,28.57 v85.72,28.57 | 40.83,22.07 40.83,19.71 40.89,19.65 | 38.59,22.84 40.64,24.89 JP12.1 v41.91,22.86 v41.91,25.4 | 67.56,18.8 67.56,21.34 68.29,22.07 v71.52,16.73 | C27.1 68.94,18.8 67.56,18.8 | TP13.P$1 67.56,16.11 67.56,16.51 | 67.56,16.51 67.56,18.8 | 71.84,15.88 71.2,16.51 67.56,16.51
  Top 0.813: C26.1 C27.1
  Bottom 0.305: v3.21,37.15 10.78,37.15 11.41,36.51 11.41,34.31 v5.84,34.04 | v46.76,14.61 46.76,13.34 | v53.76,14.61 53.76,13.34 | v19.18,2.79 20.45,4.06
  Bottom 0.61: 23.5,17.81 33.59,17.81 37.78,13.62 v37.78,11.09 38.22,22.84 38.59,22.84 39.37,22.07 v71.52,16.73 83.03,22.07 83.5,22.54 83.5,27.94 84.14,28.57 v85.72,28.57 | 16.51,21.59 16.51,20.95 20.45,4.06 24.13,13.34 v28.57,13.34 v39.37,13.34 46.76,13.34 53.76,13.34 63.01,13.34 65.42,15.75 TP13.P$1 | v93.31,28.57 v90.17,28.57
3.3V1  (1 unrouted)
3V3EN  (via drill 0.33)
  Top 0.305: IC2.4 v17.81,4.76 | v76.83,14.61 76.83,16 | 76.83,16 76.83,20.19 76.45,20.57 75.4,20.57 U4.3 | TP2.P$1 73.66,16 76.83,16
  Bottom 0.305: v17.81,4.76 75.56,4.76 76.83,6.03 v76.83,14.61
BATT_STAT  (via drill 0.33)
  Top 0.305: R17.1 TP3.P$1 87.94,18.89 87.31,19.53 v84.61,19.53 | GND.31 26.8,11.9 26.8,13.17 U$3.31 29.94,16.07 v29.97,16.07
  Bottom 0.305: v29.97,16.07 33.59,16.07 36.51,13.14 35.24,19.84 35.88,19.21 39.21,19.21 39.85,19.84 83.66,19.84 83.98,19.53 v84.61,19.53
D+
  Top 0.305: GND.4 21.1,5.49 20.25,5.49 U$3.4 19.14,4.38 14.29,18.1 13.67,17.48 R9.2
D-
  Top 0.305: GND.3 20.87,5.97 19.59,5.97 U$3.3 18.48,4.86 14.29,18.57 13.92,18.94 R10.2
DATA1  (via drill 0.33, 0.6, 1.02 pad 1.88)
  Top 0.305: GND.37 22.51,11.67 22.51,12.52 U$3.37 18.93,16.86 7.62,30.32 6.99,30.96 v6.99,31.75 6.99,32.38 10.16,35.56 12.19,35.56 v6.1,29.72
  Top 0.406: JP3.1 v44.45,22.86 v44.45,25.4
  Bottom 0.305: v6.99,31.75 6.99,32.41 | v6.1,29.72 16.26,19.3 33.78,19.3 37.85,27.43 37.85,25.65 40.13,23.37 42.67,23.37 43.18,23.88 JP3.1
DATA2  (via drill 0.33, 1.02 pad 1.88)
  Top 0.305: GND.36 22.99,11.9 22.99,13.17 U$3.36 19.59,17.34 11.43,30.8 10.79,31.43 v5.46,31.24
  Top 0.406: JP2.1 v46.99,22.86 v46.99,25.4
  Bottom 0.305: JP2.1 45.72,23.62 44.96,22.86 39.88,22.86 37.34,25.4 37.34,27.18 33.53,18.8 11.3,32.26 v5.46,31.24
DATA3  (via drill 0.33, 1.02 pad 1.88)  (1 unrouted)
  Top 0.305: GND.1 18.6,7.24 U$3.1 | 16.57,19.68 15.88,19.68 | v56.67,12.38 56.67,19.34 60.96,23.62 JP6.1
  Top 0.406: U$3.1 16.57,19.68 | JP6.1 v62.23,22.86 v62.23,25.4
  Bottom 0.305: 15.88,19.68 15.88,17.78 18.86,1.84 21.72,1.84 24.13,12.38 v56.67,12.38
DATA4  (via drill 0.33, 1.02 pad 1.88)
  Top 0.305: v26.67,10.95 26.67,13.39 U$3.12 24.77,15.3 GND.12 | v58.1,10.48 58.1,18.48 63.5,23.88 JP7.1
  Top 0.406: JP7.1 v64.77,22.86 v64.77,25.4
  Bottom 0.305: v26.67,10.95 27.15,10.48 v58.1,10.48
DATA5  (via drill 1.02 pad 1.88)
  other vias: 34.29,22.86
DATA6  (via drill 1.02 pad 1.88)
  other vias: 106.68,58.17
DATA7  (1 unrouted)
DATA8  (via drill 1.02 pad 1.88)
  other vias: 19.05,22.86
GND  (via drill 0.33, 1.02 pad 1.88)  (3 unrouted)
  Top 0.305: GND.35 23.54,12.05 23.54,13.75 U$3.35 | GND.43 20.71,9.22 19.02,9.22 U$3.43 | U$3.33 26.04,14.42 GND.33 | U$3.23 31.18,8.51 GND.23 | GND.5 21.33,5.02 20.9,5.02 U$3.5 | GND.15 27.27,4.08 27.27,3.23 U$3.15
  Top 0.61: JP11.1 v67.31,22.86 v67.31,25.4
  other vias: 25.4,15.43 40.64,14.99 35.31,14.99 74.17,17.53 63.25,10.41 61.21,12.19 5.59,37.08 5.84,35.56 8.64,25.65 24.38,10.92 20.07,6.1 35.56,6.1 55.12,5.84 67.82,5.84 81.79,16 89.92,18.29 93.47,32.26
  pour Bottom: 96.52,50.8 96.52,0 0,0 0,50.8 15.49,50.8 15.49,34.54 16.51,33.53 32.77,33.53 38.1,28.19 80.01,28.19 81.03,29.21 81.03,50.8
  pour Top: 96.52,50.8 96.52,0 0,0 0,50.8 15.49,50.8 15.49,34.54 16.51,33.53 32.77,33.53 38.1,28.19 80.01,28.19 81.03,29.21 81.03,50.8
GND1  (via drill 1.02 pad 1.88)
  other vias: 39.37,22.86
LCD_A0  (via drill 0.33)
  Top 0.305: GND.25 28.92,9.78 30.19,9.78 U$3.25 31.46,11.05 v32.77,11.05 | v49.76,15.24 X1.8 49.76,8.01 49.01,7.26 X2.8
  Bottom 0.305: v49.76,15.24 49.76,15.72 49.12,16.35 33.66,2.63 32.77,3.52 v32.77,11.05
LCD_BL  (via drill 0.33)
  Top 0.305: GND.27 28.46,10.73 28.88,10.73 U$3.27 30.79,12.64 v30.73,12.64 | R19.2 53.5,17.78 TP5.P$1
  Bottom 0.305: v30.73,12.64 33.27,12.64 34.61,12.06 33.34,17.94 33.97,17.3 54.2,17.3 TP5.P$1
LCD_CS  (via drill 0.33)  (1 unrouted)
  Top 0.305: X2.10 50.01,6.99 51.76,8.74 X1.10 51.76,18.1 | v31.78,13.43 30.45,13.43 U$3.28 GND.28
  Bottom 0.305: v31.78,13.43 33.18,13.43 35.08,12.29 33.81,18.41 34.45,17.78 51.44,17.78 51.76,18.1
LCD_RST  (via drill 0.33)
  Top 0.305: GND.26 28.69,10.26 29.54,10.26 U$3.26 31.12,11.84 v31.78,11.84 | v50.76,14.61 X1.9 50.76,8.37 49.51,7.12 X2.9
  Bottom 0.305: v50.76,14.61 50.76,16.19 50.12,16.83 33.43,16.83 33.53,3.78 33.53,11.43 33.12,11.84 v31.78,11.84
MISO  (via drill 0.33, 1.02 pad 1.88)  (2 unrouted)
  Top 0.305: v68.54,9.65 J1.7 | GND.11 23.49,15.3 U$3.11 22.1,13.9 v22.1,11.59 | v54.61,9.65 54.61,16 55.88,17.27 55.88,21.08 58.42,23.62 JP10.1
  Top 0.406: JP10.1 v103.63,58.42 v59.69,25.4
  Bottom 0.305: v68.54,9.65 v54.61,9.65 22.73,9.65 22.1,10.29 v22.1,11.59
MISO1  (via drill 1.02 pad 1.88)
  other vias: 31.75,22.86
MOSI  (via drill 0.33, 1.02 pad 1.88)  (2 unrouted)
  Top 0.305: v72.94,8.89 J1.3 | GND.10 23.54,3.7 23.54,2 U$3.10 21.27,14.21 v21.27,12.38 | X2.6 48.01,7.87 47.76,8.12 v47.76,8.89 X1.6 47.76,16.77 53.34,22.35 JP9.1
  Top 0.406: JP9.1 v54.61,22.86 v54.61,25.4
  Bottom 0.305: v21.27,12.38 21.27,9.53 21.91,8.89 v47.76,8.89 v72.94,8.89
MOSI1  (via drill 1.02 pad 1.88)
  other vias: 26.67,22.86
N$1
  Top 0.406: C4.1 73.44,21.34 U4.4
N$2
  Top 0.305: U3.1 R17.2
N$4
  Top 0.305: R19.1 X1.11 52.76,9.1 50.51,6.85 X2.11
N$5  (via drill 1.02 pad 1.88)
  other vias: 21.59,35.56
N$7
  Top 0.305: R3.1 U3.5
N$10
  Bottom 0.61: SJ1.2 81.04,9.95 80.72,9.63 U$2.P$1
N$11  (via drill 1.02 pad 1.88)
  other vias: 41.91,33.02
N$12  (via drill 0.33)
  Top 0.305: Q1.1 v84.77,12.14 | v85.09,8.26 85.09,5.56 84.45,4.92 83.19,4.92 82.55,4.29 U2.2
  Bottom 0.305: v84.77,12.14 84.77,11.11 85.09,10.79 v85.09,8.26
N$13  (via drill 1.02 pad 1.88)
  other vias: 39.37,35.56
N$14  (via drill 1.02 pad 1.88)
  other vias: 74.93,35.56
N$15
  Top 0.305: GND.42 20.87,9.78 19.59,9.78 U$3.42 18,11.37 C3.1
N$16  (via drill 1.02 pad 1.88)
  other vias: 83.82,20.32
N$17
  Top 0.305: GND.2 20.71,6.53 19.02,6.53 U$3.2
N$20  (via drill 1.02 pad 1.88)
  other vias: 24.13,35.56
N$25  (via drill 1.02 pad 1.88)
  other vias: 36.83,35.56
N$26  (via drill 1.02 pad 1.88)
  other vias: 39.37,25.4
N$27  (via drill 1.02 pad 1.88)
  other vias: 41.91,35.56
N$28  (via drill 1.02 pad 1.88)
  other vias: 44.45,35.56
N$29  (via drill 1.02 pad 1.88)
  other vias: 44.45,33.02
N$31
  Top 0.305: U$1.PIN$2 6.77,18.94 | 6.77,18.94 R10.1 | Z2.2 6.77,18.94
N$33
  Top 0.305: U$1.PIN$3 6.77,18.29 | 6.77,18.29 9.75,18.29 10.21,17.83 10.4,17.64 10.56,17.48 R9.1 | Z1.2 6.77,18.29
N$34  (via drill 1.02 pad 1.88)
  other vias: 46.99,33.02
N$35  (via drill 1.02 pad 1.88)
  other vias: 46.99,35.56
N$36  (via drill 1.02 pad 1.88)
  other vias: 49.53,35.56
N$37
  Top 0.305: C35.1 X1.3 44.76,9.21 46.51,7.46 X2.3
N$38
  Top 0.305: C35.2 43.76,16.41 X1.2 43.76,9.58 46.01,7.33 X2.2
N$39
  Top 0.305: C36.2 X1.1 42.76,9.95 45.51,7.2 X2.1
N$40  (via drill 1.02 pad 1.88)
  other vias: 49.53,33.02
N$41  (via drill 1.02 pad 1.88)
  other vias: 52.07,33.02
N$43  (via drill 1.02 pad 1.88)
  other vias: 83.82,22.86
N$55  (via drill 1.02 pad 1.88)
  other vias: 82.55,40.64
N$56  (via drill 1.02 pad 1.88)
  other vias: 100.33,55.63
N$57  (via drill 1.02 pad 1.88)
  other vias: 102.87,55.63
N$58  (via drill 1.02 pad 1.88)
  other vias: 105.41,55.63
N$59  (via drill 1.02 pad 1.88)
  other vias: 107.95,55.63
N$60  (via drill 1.02 pad 1.88)
  other vias: 110.49,55.63
N$61  (via drill 1.02 pad 1.88)
  other vias: 54.61,33.02
N$62  (via drill 1.02 pad 1.88)
  other vias: 57.15,33.02
N$63  (via drill 1.02 pad 1.88)
  other vias: 59.69,33.02
N$64  (via drill 1.02 pad 1.88)
  other vias: 62.23,33.02
N$65  (via drill 1.02 pad 1.88)
  other vias: 64.77,33.02
N$66  (via drill 1.02 pad 1.88)
  other vias: 67.31,33.02
N$67  (via drill 1.02 pad 1.88)
  other vias: 67.31,35.56
N$68  (via drill 1.02 pad 1.88)
  other vias: 64.77,35.56
N$69  (via drill 1.02 pad 1.88)
  other vias: 62.23,35.56
N$70  (via drill 1.02 pad 1.88)
  other vias: 59.69,35.56
N$71  (via drill 1.02 pad 1.88)
  other vias: 57.15,35.56
N$72  (via drill 1.02 pad 1.88)
  other vias: 54.61,35.56
N$73  (via drill 1.02 pad 1.88)
  other vias: 52.07,35.56
N$74  (via drill 1.02 pad 1.88)
  other vias: 52.07,38.1
N$75  (via drill 1.02 pad 1.88)
  other vias: 54.61,38.1
N$76  (via drill 1.02 pad 1.88)
  other vias: 54.61,40.64
N$77  (via drill 1.02 pad 1.88)
  other vias: 52.07,40.64
N$78  (via drill 1.02 pad 1.88)
  other vias: 52.07,43.18
N$79  (via drill 1.02 pad 1.88)
  other vias: 54.61,43.18
N$82  (via drill 1.02 pad 1.88)
  other vias: 72.39,25.4
N$83  (via drill 1.02 pad 1.88)
  other vias: 69.85,25.4
N$84  (via drill 1.02 pad 1.88)
  other vias: 69.85,33.02
N$85  (via drill 1.02 pad 1.88)
  other vias: 72.39,33.02
N$86  (via drill 1.02 pad 1.88)
  other vias: 74.93,25.4
N$89  (via drill 1.02 pad 1.88)
  other vias: 19.05,43.18
N$90  (via drill 1.02 pad 1.88)
  other vias: 80.01,25.4 100.84,57.91
N$91  (via drill 1.02 pad 1.88)
  other vias: 77.47,25.4
N$92  (via drill 1.02 pad 1.88)
  other vias: 82.55,27.94
N$93  (via drill 1.02 pad 1.88)
  other vias: 77.47,35.56
N$94  (via drill 1.02 pad 1.88)
  other vias: 77.47,38.1
N$95  (via drill 1.02 pad 1.88)
  other vias: 74.93,38.1
N$96  (via drill 1.02 pad 1.88)
  other vias: 74.93,33.02
N$97  (via drill 1.02 pad 1.88)
  other vias: 72.39,35.56
N$98  (via drill 1.02 pad 1.88)
  other vias: 72.39,38.1
N$99  (via drill 1.02 pad 1.88)
  other vias: 69.85,35.56
N$100  (via drill 1.02 pad 1.88)
  other vias: 69.85,38.1
N$101  (via drill 1.02 pad 1.88)
  other vias: 82.55,30.48
N$102  (via drill 1.02 pad 1.88)
  other vias: 80.01,40.64
N$103  (via drill 1.02 pad 1.88)
  other vias: 80.01,43.18
N$104  (via drill 1.02 pad 1.88)
  other vias: 80.01,45.72
N$105  (via drill 1.02 pad 1.88)  (4 unrouted)
  other vias: 80.01,48.26 82.55,35.56 82.55,38.1 82.55,33.02 82.55,25.4
N$106  (via drill 1.02 pad 1.88)
  other vias: 77.47,48.26
N$107  (via drill 1.02 pad 1.88)
  other vias: 72.39,48.26
N$108  (via drill 1.02 pad 1.88)
  other vias: 74.93,48.26
N$109  (via drill 1.02 pad 1.88)
  other vias: 54.61,48.26
N$110  (via drill 1.02 pad 1.88)
  other vias: 44.45,48.26
N$111  (via drill 1.02 pad 1.88)
  other vias: 19.05,40.64
N$112  (via drill 1.02 pad 1.88)
  other vias: 13.97,35.56
N$113  (via drill 1.02 pad 1.88)
  other vias: 19.05,38.1
N$114  (via drill 1.02 pad 1.88)
  other vias: 26.67,35.56
N$115  (via drill 1.02 pad 1.88)
  other vias: 29.21,35.56
N$116  (via drill 1.02 pad 1.88)
  other vias: 31.75,35.56
N$117  (via drill 1.02 pad 1.88)
  other vias: 34.29,35.56
N$118  (via drill 1.02 pad 1.88)
  other vias: 39.37,33.02
N$119  (1 unrouted)
N$120  (via drill 1.02 pad 1.88)
  other vias: 19.05,35.56
N$121  (via drill 1.02 pad 1.88)
  other vias: 21.59,38.1
N$122  (via drill 1.02 pad 1.88)
  other vias: 24.13,38.1
N$123  (via drill 1.02 pad 1.88)
  other vias: 41.91,40.64
N$124  (via drill 1.02 pad 1.88)
  other vias: 41.91,38.1
N$125  (via drill 1.02 pad 1.88)
  other vias: 46.99,38.1
N$126  (via drill 1.02 pad 1.88)
  other vias: 49.53,38.1
N$127  (via drill 1.02 pad 1.88)
  other vias: 44.45,38.1
N$128  (via drill 1.02 pad 1.88)
  other vias: 44.45,40.64
N$129  (via drill 1.02 pad 1.88)
  other vias: 46.99,40.64
N$130  (via drill 1.02 pad 1.88)
  other vias: 49.53,40.64
N$131  (via drill 1.02 pad 1.88)
  other vias: 57.15,38.1
N$132  (via drill 1.02 pad 1.88)
  other vias: 59.69,38.1
N$133  (via drill 1.02 pad 1.88)
  other vias: 62.23,38.1
N$134  (via drill 1.02 pad 1.88)
  other vias: 64.77,38.1
N$135  (via drill 1.02 pad 1.88)
  other vias: 67.31,38.1
N$136  (via drill 1.02 pad 1.88)
  other vias: 57.15,40.64
N$137  (via drill 1.02 pad 1.88)
  other vias: 57.15,43.18
N$138  (via drill 1.02 pad 1.88)
  other vias: 105.41,60.96
N$139  (via drill 1.02 pad 1.88)
  other vias: 59.69,40.64
N$140  (via drill 1.02 pad 1.88)
  other vias: 62.23,40.64
N$141  (via drill 1.02 pad 1.88)
  other vias: 62.23,43.18
N$142  (via drill 1.02 pad 1.88)
  other vias: 64.77,43.18
N$143  (via drill 1.02 pad 1.88)
  other vias: 64.77,40.64
N$144  (via drill 1.02 pad 1.88)
  other vias: 67.31,40.64
N$145  (via drill 1.02 pad 1.88)
  other vias: 67.31,43.18
N$146  (via drill 1.02 pad 1.88)
  other vias: 69.85,43.18
N$147  (via drill 1.02 pad 1.88)
  other vias: 69.85,40.64
N$148  (via drill 1.02 pad 1.88)
  other vias: 72.39,40.64
N$149  (via drill 1.02 pad 1.88)
  other vias: 72.39,43.18
N$150  (via drill 1.02 pad 1.88)
  other vias: 74.93,43.18
N$151  (via drill 1.02 pad 1.88)
  other vias: 74.93,40.64
N$152  (via drill 1.02 pad 1.88)
  other vias: 77.47,40.64
N$153  (via drill 1.02 pad 1.88)
  other vias: 77.47,43.18
N$154  (via drill 1.02 pad 1.88)
  other vias: 77.47,45.72
N$155  (via drill 1.02 pad 1.88)
  other vias: 74.93,45.72
N$156  (via drill 1.02 pad 1.88)
  other vias: 72.39,45.72
N$157  (via drill 1.02 pad 1.88)
  other vias: 69.85,45.72
N$158  (via drill 1.02 pad 1.88)
  other vias: 67.31,45.72
N$159  (via drill 1.02 pad 1.88)
  other vias: 64.77,45.72
N$160  (via drill 1.02 pad 1.88)
  other vias: 62.23,45.72
N$161  (via drill 1.02 pad 1.88)
  other vias: 109.22,58.67
N$162  (via drill 1.02 pad 1.88)
  other vias: 57.15,45.72
N$163  (via drill 1.02 pad 1.88)
  other vias: 54.61,45.72
N$164  (via drill 1.02 pad 1.88)
  other vias: 52.07,45.72
N$165  (via drill 1.02 pad 1.88)
  other vias: 52.07,48.26
N$166  (via drill 1.02 pad 1.88)
  other vias: 57.15,48.26
N$167  (via drill 1.02 pad 1.88)
  other vias: 108.2,61.21
N$168  (via drill 1.02 pad 1.88)
  other vias: 62.23,48.26
N$169  (via drill 1.02 pad 1.88)
  other vias: 64.77,48.26
N$170  (via drill 1.02 pad 1.88)
  other vias: 67.31,48.26
N$171  (via drill 1.02 pad 1.88)
  other vias: 69.85,48.26
N$172  (via drill 1.02 pad 1.88)
  other vias: 49.53,48.26
N$173  (via drill 1.02 pad 1.88)
  other vias: 49.53,45.72
N$174  (via drill 1.02 pad 1.88)
  other vias: 49.53,43.18
N$175  (via drill 1.02 pad 1.88)
  other vias: 46.99,43.18
N$176  (via drill 1.02 pad 1.88)
  other vias: 46.99,45.72
N$177  (via drill 1.02 pad 1.88)
  other vias: 46.99,48.26
N$178  (via drill 1.02 pad 1.88)
  other vias: 41.91,48.26
N$179  (via drill 1.02 pad 1.88)
  other vias: 41.91,45.72
N$180  (via drill 1.02 pad 1.88)
  other vias: 41.91,43.18
N$181  (via drill 1.02 pad 1.88)
  other vias: 44.45,43.18
N$182  (via drill 1.02 pad 1.88)
  other vias: 44.45,45.72
N$183  (via drill 1.02 pad 1.88)
  other vias: 26.67,38.1
N$184  (via drill 1.02 pad 1.88)
  other vias: 29.21,38.1
N$185  (via drill 1.02 pad 1.88)
  other vias: 31.75,38.1
N$186  (via drill 1.02 pad 1.88)
  other vias: 34.29,38.1
N$187  (via drill 1.02 pad 1.88)
  other vias: 36.83,38.1
N$188  (via drill 1.02 pad 1.88)
  other vias: 39.37,38.1
N$189  (via drill 1.02 pad 1.88)
  other vias: 39.37,40.64
N$190  (via drill 1.02 pad 1.88)
  other vias: 39.37,43.18
N$191  (via drill 1.02 pad 1.88)
  other vias: 39.37,45.72
N$192  (via drill 1.02 pad 1.88)
  other vias: 39.37,48.26
N$193  (via drill 1.02 pad 1.88)
  other vias: 36.83,48.26
N$194  (via drill 1.02 pad 1.88)
  other vias: 34.29,48.26
N$195  (via drill 1.02 pad 1.88)
  other vias: 31.75,48.26
N$196  (via drill 1.02 pad 1.88)
  other vias: 29.21,48.26
N$197  (via drill 1.02 pad 1.88)
  other vias: 26.67,48.26
N$198  (via drill 1.02 pad 1.88)
  other vias: 24.13,48.26
N$199  (via drill 1.02 pad 1.88)
  other vias: 21.59,48.26
N$200  (via drill 1.02 pad 1.88)
  other vias: 19.05,48.26
N$201  (via drill 1.02 pad 1.88)
  other vias: 19.05,45.72
N$202  (1 unrouted)
N$203  (via drill 1.02 pad 1.88)
  other vias: 13.97,33.02
N$204  (via drill 1.02 pad 1.88)
  other vias: 21.59,40.64
N$205  (via drill 1.02 pad 1.88)
  other vias: 24.13,40.64
N$206  (via drill 1.02 pad 1.88)
  other vias: 26.67,40.64
N$207  (via drill 1.02 pad 1.88)
  other vias: 29.21,40.64
N$208  (via drill 1.02 pad 1.88)
  other vias: 31.75,40.64
N$209  (via drill 1.02 pad 1.88)
  other vias: 34.29,40.64
N$210  (via drill 1.02 pad 1.88)
  other vias: 36.83,40.64
N$211  (via drill 1.02 pad 1.88)
  other vias: 13.97,48.26
N$212  (via drill 1.02 pad 1.88)
  other vias: 34.29,43.18
N$213  (via drill 1.02 pad 1.88)
  other vias: 31.75,43.18
N$214  (via drill 1.02 pad 1.88)
  other vias: 29.21,43.18
N$215  (via drill 1.02 pad 1.88)
  other vias: 26.67,43.18
N$216  (via drill 1.02 pad 1.88)
  other vias: 24.13,43.18
N$217  (via drill 1.02 pad 1.88)
  other vias: 21.59,43.18
N$218  (via drill 1.02 pad 1.88)
  other vias: 21.59,45.72
N$219  (via drill 1.02 pad 1.88)
  other vias: 24.13,45.72
N$220  (via drill 1.02 pad 1.88)
  other vias: 26.67,45.72
N$221  (via drill 1.02 pad 1.88)
  other vias: 29.21,45.72
N$222  (via drill 1.02 pad 1.88)
  other vias: 31.75,45.72
N$223  (via drill 1.02 pad 1.88)
  other vias: 34.29,45.72
N$224  (via drill 1.02 pad 1.88)
  other vias: 59.69,48.26
N$225  (via drill 1.02 pad 1.88)
  other vias: 113.03,55.63
N$226  (via drill 1.02 pad 1.88)
  other vias: 115.57,55.63
N$227  (1 unrouted)
N$228  (via drill 1.02 pad 1.88)
  other vias: 19.05,25.4 16.51,22.86
N$229  (via drill 1.02 pad 1.88)
  other vias: 21.59,33.02
N$230  (via drill 1.02 pad 1.88)
  other vias: 24.13,33.02
N$231  (via drill 1.02 pad 1.88)
  other vias: 26.67,33.02
N$232  (via drill 1.02 pad 1.88)
  other vias: 29.21,33.02
N$233  (via drill 1.02 pad 1.88)
  other vias: 31.75,33.02
N$234  (via drill 1.02 pad 1.88)
  other vias: 34.29,33.02
N$235  (via drill 1.02 pad 1.88)
  other vias: 36.83,33.02
N$236  (via drill 1.02 pad 1.88)
  other vias: 36.83,25.4
N$237  (via drill 1.02 pad 1.88)
  other vias: 21.59,25.4
N$238  (via drill 1.02 pad 1.88)
  other vias: 24.13,25.4
N$239  (via drill 1.02 pad 1.88)
  other vias: 69.85,22.86
N$240  (via drill 1.02 pad 1.88)
  other vias: 72.39,22.86
N$241  (via drill 1.02 pad 1.88)
  other vias: 74.93,22.86
N$242  (via drill 1.02 pad 1.88)
  other vias: 77.47,22.86
N$243  (via drill 1.02 pad 1.88)
  other vias: 80.01,22.86
N$244  (via drill 1.02 pad 1.88)
  other vias: 19.05,33.02 13.97,25.4 82.55,48.26 97.03,54.1
N$245  (via drill 1.02 pad 1.88)
  other vias: 26.67,25.4
N$246  (via drill 1.02 pad 1.88)
  other vias: 29.21,25.4
N$247  (via drill 1.02 pad 1.88)
  other vias: 31.75,25.4
N$248  (via drill 1.02 pad 1.88)
  other vias: 34.29,25.4
N$249  (via drill 1.02 pad 1.88)
  other vias: 16.51,35.56
N$250  (via drill 1.02 pad 1.88)
  other vias: 16.51,48.26
N$251  (via drill 1.02 pad 1.88)
  other vias: 16.51,45.72
N$252  (via drill 1.02 pad 1.88)
  other vias: 16.51,43.18
N$253  (via drill 1.02 pad 1.88)
  other vias: 16.51,40.64 13.97,40.64
N$254  (via drill 1.02 pad 1.88)
  other vias: 16.51,38.1 13.97,38.1
N$255  (via drill 1.02 pad 1.88)
  other vias: 16.51,25.4
N$256  (via drill 1.02 pad 1.88)
  other vias: 16.51,33.02
N$257  (via drill 1.02 pad 1.83)
  other vias: 80.01,38.1
N$258  (via drill 1.02 pad 1.83)
  other vias: 80.01,35.56
N$259  (via drill 1.02 pad 1.83)
  other vias: 80.01,33.02
N$260  (via drill 1.02 pad 1.83)
  other vias: 80.01,30.48
N$261  (via drill 1.02 pad 1.83)
  other vias: 80.01,27.94
N$262  (via drill 1.02 pad 1.83)
  other vias: 77.47,27.94
N$263  (via drill 1.02 pad 1.83)
  other vias: 77.47,30.48
N$264  (via drill 1.02 pad 1.83)
  other vias: 77.47,33.02
PWR_ONOFF  (via drill 0.33)
  Top 0.305: GND.41 21.1,10.26 20.25,10.26 U$3.41 18.06,13.21 TP9.P$1 | R7.2 v13.97,12.7 IC2.1
  Bottom 0.305: TP9.P$1 15.24,12.52 15.24,10.03 | 15.24,10.03 v13.97,12.7 | JP1.2 15.24,10.03
RESET  (via drill 0.33)  (2 unrouted)
  Top 0.305: GND.13 26.24,3.7 26.24,2 U$3.13 27.5,13.7 v27.5,11.59 | R4.1 v34.79,11.27
  Bottom 0.305: v27.5,11.59 27.81,11.27 v34.79,11.27
SCK  (via drill 0.33, 1.02 pad 1.88)  (2 unrouted)
  Top 0.305: v70.74,8.13 J1.5 | GND.9 22.99,3.85 22.99,2.58 U$3.9 20.45,14.51 v20.45,11.59 | X2.7 48.51,7.88 v48.76,8.13 X1.7 48.76,16.5 55.88,23.62 JP8.1
  Top 0.406: JP8.1 v57.15,22.86 v57.15,25.4
  Bottom 0.305: v70.74,8.13 v48.76,8.13 21.08,8.13 20.45,8.76 v20.45,11.59
SCK1  (via drill 1.02 pad 1.88)
  other vias: 29.21,22.86
SCL  (via drill 1.02 pad 1.88)
  Top 0.305: GND.18 28.46,5.02 28.88,5.02 U$3.18 30.79,3.11 40.85,16.83 R14.1 47.66,17.95 50.8,21.08 JP5.1
  Top 0.406: JP5.1 v52.07,22.86 v52.07,25.4
SCL1  (via drill 1.02 pad 1.88)
  other vias: 24.13,22.86
SD_CS  (via drill 0.33)
  Top 0.305: TP7.P$1 J1.2 | GND.8 22.51,4.08 22.51,3.23 U$3.8 19.68,14.88 v19.68,12.38
  Bottom 0.305: v19.68,12.38 19.68,7.94 20.32,7.3 TP7.P$1
SDA  (via drill 1.02 pad 1.88)
  Top 0.305: GND.19 28.69,5.49 29.54,5.49 U$3.19 31.12,3.9 39.68,17.62 R13.1 40.04,17.95 40.89,18.8 47.24,18.8 48.26,19.81 JP4.1
  Top 0.406: JP4.1 v49.53,22.86 v49.53,25.4
SDA1  (via drill 1.02 pad 1.88)
  other vias: 21.59,22.86
SW_A  (via drill 0.33)  (1 unrouted)
  Top 0.305: GND.21 29.07,6.53 30.77,6.53 U$3.21 31.96,5.33 35.56,19.05 37.78,21.27 | S3.3 90.97,37.97 91.61,37.34 R8.2 91.61,25.4 90.97,24.77 88.27,24.77 87.63,24.13 87.63,22.7 87,22.07 v86.1,22.07
  Bottom 0.305: v86.1,22.07 84.3,22.07 83.5,21.27 37.78,21.27
SW_B  (via drill 0.33)  (1 unrouted)
  Top 0.305: GND.20 28.92,5.97 30.19,5.97 U$3.20 31.46,4.7 36.51,18.41 38.58,20.48 | S2.3 90.97,23.5 91.61,22.86 R11.2 90.33,21.59 89.85,21.11 v85.12,21.11
  Bottom 0.305: v85.12,21.11 84.14,21.11 83.82,20.8 38.89,20.8 38.58,20.48
SW_C  (via drill 0.33)
  Top 0.305: S1.3 90.97,9.02 91.61,9.65 R12.2 91.61,19.68 90.97,20.32 v86.1,20.32 | GND.32 26.24,12.05 26.24,13.75 U$3.32 28.23,15.48 v36.61,6.95
  Bottom 0.305: v36.61,6.95 33.56,16.86 36.99,13.43 35.72,20.32 36.35,19.68 38.89,19.68 39.53,20.32 v86.1,20.32
SW_D
  Top 0.305: S4.3 4.33,37.97 4.91,37.39 R15.2 4.91,31.11 6.18,29.84 18.28,16.38 U$3.38 22.04,11.86 22.04,11.44 GND.38
SW_E
  Top 0.305: S5.3 5.6,27.3 4.91,27.99 R16.2 17.78,15.75 U$3.39 GND.39
SW_PWR  (via drill 0.33)
  Top 0.305: GND.40 21.33,10.73 20.9,10.73 U$3.40 17.92,14.48 TP1.P$1 | v8.03,9.02 S6.1 | v11.17,9.02 12.28,9.02 12.91,9.65 R6.2 13.81,11.27 v13.97,11.43 14.29,11.75 IC2.2
  Bottom 0.305: v11.17,9.02 v8.03,9.02 | v13.97,11.43 13.18,12.22 14.45,13.68 15.24,14.48 TP1.P$1
TXLED
  Top 0.305: U$3.22 31.18,7.24 GND.22
USBVCC  (via drill 0.33)
  Top 0.305: U$1.PIN$1 5.4,19.59 v5.4,20.32 5.4,21.59 6.03,22.23 TP10.P$1
  Top 1.016: v5.4,14.92 F1.1
  Bottom 1.016: v5.4,20.32 v5.4,14.92
VBAT
  Top 0.305: Q1.3 82.63,14.61 83.29,15.27 R20.2
  Top 0.406: 86.04,9.95 TP14.P$1 Q1.3 | 86.04,9.95 C9.1 | U3.3 86.04,9.95
  Bottom 0.61: SJ1.1 TP14.P$1
VBAT_EN  (via drill 0.33)
  Top 0.305: GND.30 27.27,11.67 27.27,12.52 U$3.30 30.28,15.27 v30.77,15.27 | v80.75,17.78 R24.2
  Bottom 0.305: v30.77,15.27 33.62,15.27 36.04,12.86 34.77,19.37 35.4,18.73 39.53,18.73 40.16,19.37 80.01,19.37 80.33,19.05 v80.75,17.78
VBAT_SENSE  (via drill 0.33)
  Top 0.305: GND.29 27.75,11.44 27.75,11.86 U$3.29 30.62,14.48 v31.5,14.48 | R20.1 R24.1 86.1,17.78 v86.1,18.41
  Bottom 0.305: v31.5,14.48 33.66,14.48 35.56,12.57 34.29,18.89 34.92,18.26 39.85,18.26 40.48,18.89 60.33,18.89 | 60.33,18.89 66.99,18.89 69.56,16.32 81.95,16.32 84.04,18.41 v86.1,18.41 | TP4.P$1 60.33,18.89
VBUS  (via drill 0.33)
  Top 0.305: GND.7 22.04,4.31 22.04,3.88 U$3.7 18.59,14.92 TP12.P$1 | R6.1 R7.1 11.21,13.44 11.43,13.65 14.61,13.65 14.84,13.89 D2.C | IC2.5 16.57,12.7 | 78.11,18.73 C12.1 78.11,17.91 v77.72,17.53 | U4.1 75.34,18.13 v75.95,17.53
  Top 0.61: C2.1 78.58,18.84 | C2.1 C1.1 C12.1 | Q1.2 81.68,18.84 C2.1
  Top 0.813: TP12.P$1 16.57,12.7 | 16.57,12.7 C28.1 v16.57,3.75 | 16.57,12.7 | v80.64,6.35 80.64,11.11 Q1.2
  Top 1.016: D2.C TP12.P$1
  Bottom 0.305: v75.95,17.53 v77.72,17.53
  Bottom 0.813: v80.64,6.35 80.64,5.08 79.38,3.81 16.57,3.81 v16.57,3.75
VBUS_IN  (via drill 0.33)  (2 unrouted)
  Top 0.305: D2.A F1.2
  Top 0.406: U3.4 TP11.P$1 | U2.3 v82.23,1.27
  Top 0.813: C6.1 TP11.P$1
  Top 1.016: F1.2 v9.34,1.27
  Bottom 1.016: v9.34,1.27 v82.23,1.27 86.04,1.27 | 86.04,1.27 87,1.27 arc90 89.53,3.81 arc-90 92.71,6.99 arc90 95.25,9.53 95.25,29.84 94.61,30.48 | TP11.P$1 86.04,1.27
XTAL1
  Top 0.305: GND.17 U$3.17 30.36,2.41 arc45 30.58,2.32 33.4,2.32 arc-90 33.71,2 Y1.1
XTAL2
  Top 0.305: GND.16 27.75,4.31 27.75,3.88 U$3.16 29.73,14.86 arc45 29.96,14.76 Y1.3

### Text on the board
tPlace: D | A | E | B | USBVCC | LCD_BL | VBAT_SENSE | GND | 3V3_EN | BATT_STAT | VBUS | SW_PWR | SD_CARD | C | PWR_ON/OFF | MISO | DATA3 | DATA4 | GND | MOSI | SCK | SCL | DATA1 | 3.3V | DATA2 | SDA | 3.3V | VBAT | PWR | LCD | SD_CS | VBUS_IN
bPlace: GND | GND | DATA1 | MOSI | SCL | VBS_IN | USBVCC | LCD_BL | VBAT_SENSE | GND | 3V3_EN | BATT_STAT | VBUS | SW_PWR | PWR_ON/OFF | MISO | DATA3 | DATA4 | GND | MOSI | SCK | SCL | DATA1 | 3.3V | DATA2 | SDA | 3.3V | T400D v0.10-beta1 | VBAT | SD_CS | VBUS_IN | D12 LCD_RST / D13 SW_C / D14 MISO / D15 SCK / D16 MOSI / D17 SD_CS / A0 DATA2 / A1 DATA1 / A2 SW_D / A3 SW_E / A4 SW_PWR / A5 PWR_ONOFF | Arduino pin map / D0 SW_B / D1 SW_A / D2 SDA / D3 SCL / D4 LCD_A0 / D5 BATT_STAT / D6 LCD_BL / D7 DATA3 / D8 LCD_CS / D9 VBAT_SENSE / D10 VBAT_EN / D11 DATA4
tNames: + | + | + | +
Measures: Card push position | Card Lock position | Card dashing position